# Altium schematic sheet 03 - Controller.SchDoc: Controller - 25kW WolfPACK FM3 Six-Pack Inverter
size 431 x 279 mm; Date: 01/2024; DocumentNumber: CRD25DA12N-FMC; Revision: 1.2; SheetNumber: 3; SheetTotal: 8; SheetSize: B
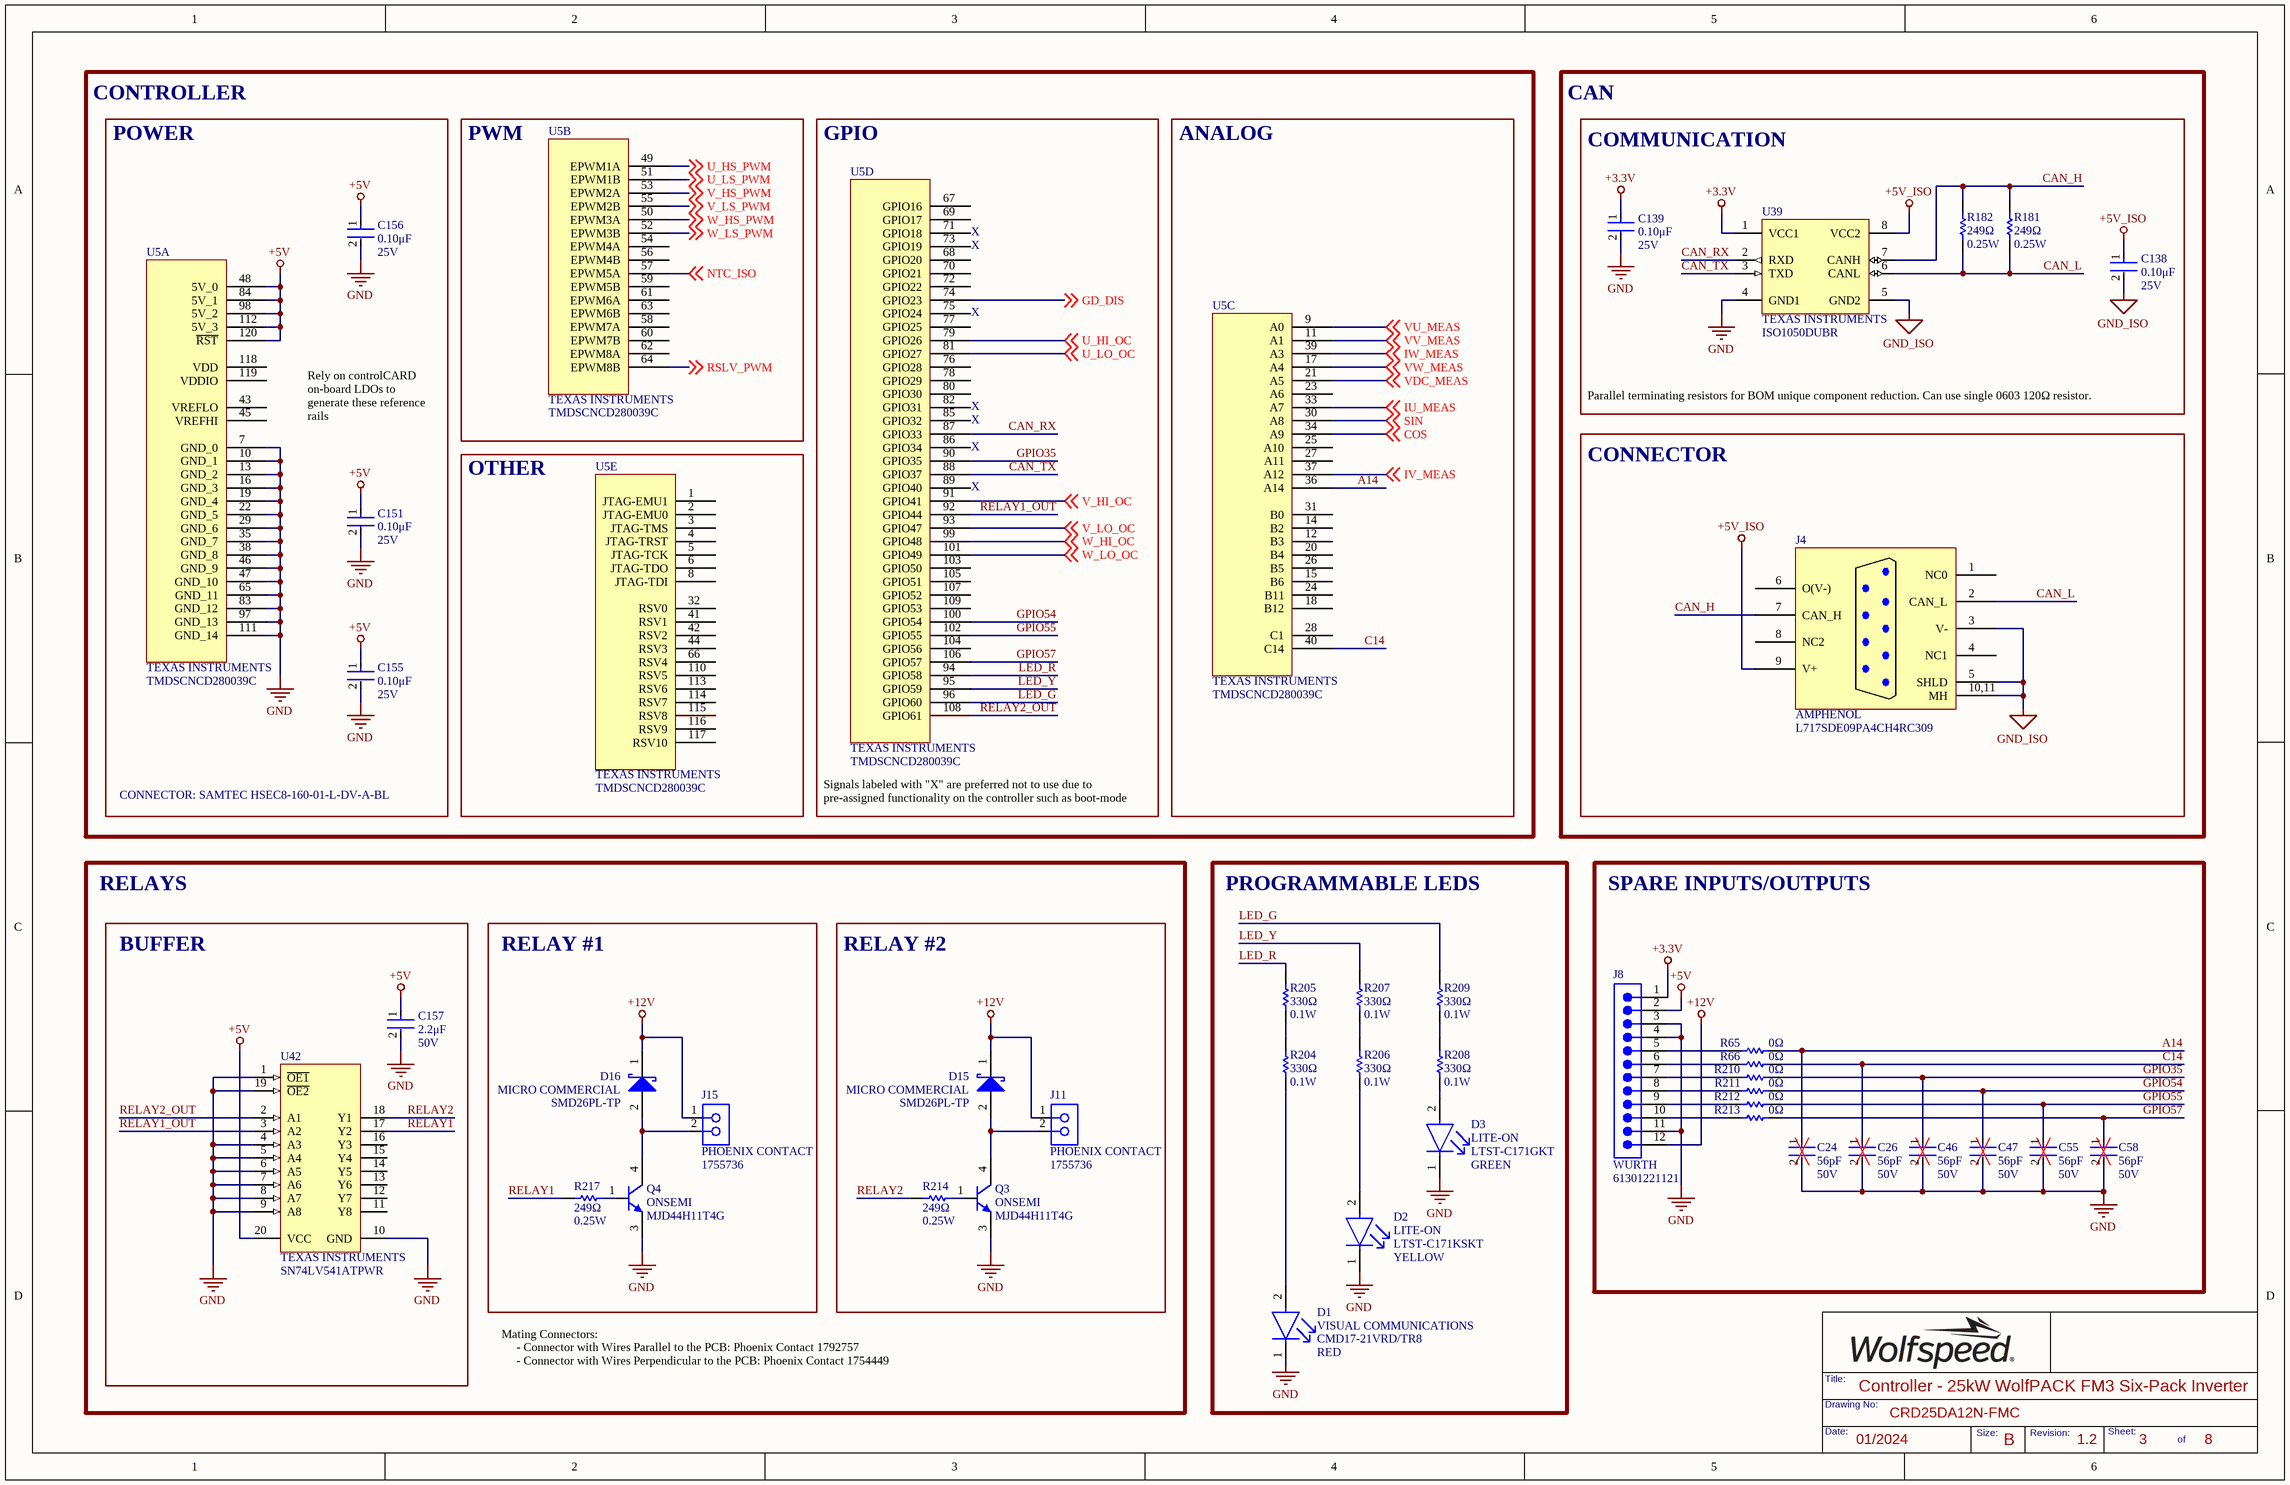
[diagram p0: 03 - Controller.SchDoc]

## Parts
C24  Capacitance: 56pF  Voltage Rating: 50V  [FP-C0603C-CF-IPC_B]  (hidden comment: CL10C560JB8NNNC)
C26  Capacitance: 56pF  Voltage Rating: 50V  [FP-C0603C-CF-IPC_B]  (hidden comment: CL10C560JB8NNNC)
C46  Capacitance: 56pF  Voltage Rating: 50V  [FP-C0603C-CF-IPC_B]  (hidden comment: CL10C560JB8NNNC)
C47  Capacitance: 56pF  Voltage Rating: 50V  [FP-C0603C-CF-IPC_B]  (hidden comment: CL10C560JB8NNNC)
C55  Capacitance: 56pF  Voltage Rating: 50V  [FP-C0603C-CF-IPC_B]  (hidden comment: CL10C560JB8NNNC)
C58  Capacitance: 56pF  Voltage Rating: 50V  [FP-C0603C-CF-IPC_B]  (hidden comment: CL10C560JB8NNNC)
C138  Voltage Rating: 25V  Capacitance: 0.10μF  [FP-C0603C-CF-IPC_B]  (hidden comment: C0603C104K3RACTU)
C139  Voltage Rating: 25V  Capacitance: 0.10μF  [FP-C0603C-CF-IPC_B]  (hidden comment: C0603C104K3RACTU)
C151  Voltage Rating: 25V  Capacitance: 0.10μF  [FP-C0603C-CF-IPC_B]  (hidden comment: C0603C104K3RACTU)
C155  Voltage Rating: 25V  Capacitance: 0.10μF  [FP-C0603C-CF-IPC_B]  (hidden comment: C0603C104K3RACTU)
C156  Voltage Rating: 25V  Capacitance: 0.10μF  [FP-C0603C-CF-IPC_B]  (hidden comment: C0603C104K3RACTU)
C157  Voltage Rating: 50V  Capacitance: 2.2μF  [FP-C0603C-CF-IPC_B]  (hidden comment: GRT188R61H225ME13D)
D1  value RED  Manufacturer: VISUAL COMMUNICATIONS  [FP-LTST-C171GKT-MFG-RED]  (hidden comment: CMD17-21VRD/TR8)
D2  LTST-C171KSKT  value YELLOW  Manufacturer: LITE-ON  [FP-LTST-C171GKT-MFG-YELLOW]
D3  value GREEN  Manufacturer: LITE-ON  [FP-LTST-C171GKT-MFG]  (hidden comment: LTST-C171GKT)
D15  SMD26PL-TP  Manufacturer: MICRO COMMERCIAL  [ONSC-SOD-123FL-2-498-01_V]
D16  SMD26PL-TP  Manufacturer: MICRO COMMERCIAL  [ONSC-SOD-123FL-2-498-01_V]
J4  Manufacturer: AMPHENOL  [L717SDE09PA4CH4RC309]  (hidden comment: L717SDE09PA4CH4RC309)
J8  Manufacturer Print: WURTH  [FP-61301221121-MFG]  (hidden comment: 61301221121)
J11  Manufacturer: PHOENIX CONTACT  [1755736]  (hidden comment: 1755736)
J15  Manufacturer: PHOENIX CONTACT  [1755736]  (hidden comment: 1755736)
Q3  Manufacturer: ONSEMI  [ONSC-DPAK-3-369C-01_V]  (hidden comment: MJD44H11T4G)
Q4  Manufacturer: ONSEMI  [ONSC-DPAK-3-369C-01_V]  (hidden comment: MJD44H11T4G)
R65  Resistance: 0Ω  [FP-MCR03-IPC_B]  (hidden comment: CRCW06030000Z0EB)
R66  Resistance: 0Ω  [FP-MCR03-IPC_B]  (hidden comment: CRCW06030000Z0EB)
R181  Resistance: 249Ω  Power Rating: 0.25W  [FP-MCR18-IPC_A]  (hidden comment: RC1206FR-07249RL)
R182  Resistance: 249Ω  Power Rating: 0.25W  [FP-MCR18-IPC_A]  (hidden comment: RC1206FR-07249RL)
R204  Resistance: 330Ω  Power Rating: 0.1W  [FP-MCR03-IPC_B]  (hidden comment: RC0603FR-13330RL)
R205  Resistance: 330Ω  Power Rating: 0.1W  [FP-MCR03-IPC_B]  (hidden comment: RC0603FR-13330RL)
R206  Resistance: 330Ω  Power Rating: 0.1W  [FP-MCR03-IPC_B]  (hidden comment: RC0603FR-13330RL)
R207  Resistance: 330Ω  Power Rating: 0.1W  [FP-MCR03-IPC_B]  (hidden comment: RC0603FR-13330RL)
R208  Resistance: 330Ω  Power Rating: 0.1W  [FP-MCR03-IPC_B]  (hidden comment: RC0603FR-13330RL)
R209  Resistance: 330Ω  Power Rating: 0.1W  [FP-MCR03-IPC_B]  (hidden comment: RC0603FR-13330RL)
R210  Resistance: 0Ω  [FP-MCR03-IPC_B]  (hidden comment: CRCW06030000Z0EB)
R211  Resistance: 0Ω  [FP-MCR03-IPC_B]  (hidden comment: CRCW06030000Z0EB)
R212  Resistance: 0Ω  [FP-MCR03-IPC_B]  (hidden comment: CRCW06030000Z0EB)
R213  Resistance: 0Ω  [FP-MCR03-IPC_B]  (hidden comment: CRCW06030000Z0EB)
R214  Resistance: 249Ω  Power Rating: 0.25W  [FP-MCR18-IPC_A]  (hidden comment: RC1206FR-07249RL)
R217  Resistance: 249Ω  Power Rating: 0.25W  [FP-MCR18-IPC_A]  (hidden comment: RC1206FR-07249RL)
U5  TMDSCNCD280039C  Manufacturer: TEXAS INSTRUMENTS  [TMDSCNCD280039C]  (parts A,B,C,D,E of 5)
U39  ISO1050DUBR  Manufacturer Print: TEXAS INSTRUMENTS  [DUB0008A_M]
U42  Manufacturer: TEXAS INSTRUMENTS  [PW0020A_L]  (hidden comment: SN74LV541ATPWR)

## Blocks framed on the sheet
POWER: C151 C155 C156 U5
PWM: U5
GPIO: U5
ANALOG: U5
COMMUNICATION: C138 C139 R181 R182 U39
CONNECTOR: J4
OTHER: U5
PROGRAMMABLE LEDS: D1-D3 R204-R209
SPARE INPUTS/OUTPUTS: C24 C26 C46 C47 C55 C58 J8 R65 R66 R210-R213
BUFFER: C157 U42
RELAY #1: D16 J15 Q4 R217
RELAY #2: D15 J11 Q3 R214

## Nets
+3.3V: C139.1 J8.1 U39.1(VCC1)
+5V: C151.1 C155.1 C156.1 C157.1 J8.2 U5.48(5V_0) U5.84(5V_1) U5.98(5V_2) U5.112(5V_3) U5.120(~{RST}) U42.20(VCC)
+5V_ISO: C138.1 J4.9(V+) U39.8(VCC2)
+12V: D15.1(K) D16.1(K) J8.12 J11.1 J15.1
GND: C24.2 C26.2 C46.2 C47.2 C55.2 C58.2 C139.2 C151.2 C155.2 C156.2 C157.2 D1.1(C) D2.1(C) D3.1(C) J8.3 J8.4 J8.11 Q3.3(E) Q4.3(E) U5.7(GND_0) U5.10(GND_1) U5.13(GND_2) U5.16(GND_3) U5.19(GND_4) U5.22(GND_5) U5.29(GND_6) U5.35(GND_7) U5.38(GND_8) U5.46(GND_9) U5.47(GND_10) U5.65(GND_11) U5.83(GND_12) U5.97(GND_13) U5.111(GND_14) U39.4(GND1) U42.1(~{OE1}) U42.4(A3) U42.5(A4) U42.6(A5) U42.7(A6) U42.8(A7) U42.9(A8) U42.10(GND) U42.19(~{OE2})
GND_ISO: C138.2 J4.3(V-) J4.5(SHLD) J4.10,11(MH) U39.5(GND2)
A14: C24.1 R65.2 U5.36(A14)
C14: C26.1 R66.2 U5.40(C14)
CAN_H: J4.7(CAN_H) R181.2 R182.2 U39.7(CANH)
CAN_L: J4.2(CAN_L) R181.1 R182.1 U39.6(CANL)
CAN_RX: U5.87(GPIO33) U39.2(RXD)
CAN_TX: U5.88(GPIO37) U39.3(TXD)
COS: U5.34(A9) ; off-sheet COS
GD_DIS: U5.74(GPIO23) ; off-sheet GD_DIS
GPIO35: C46.1 R210.2 U5.90(GPIO35)
GPIO54: C47.1 R211.2 U5.100(GPIO54)
GPIO55: C55.1 R212.2 U5.102(GPIO55)
GPIO57: C58.1 R213.2 U5.106(GPIO57)
IU_MEAS: U5.33(A7) ; off-sheet IU_MEAS
IV_MEAS: U5.37(A12) ; off-sheet IV_MEAS
IW_MEAS: U5.39(A3) ; off-sheet IW_MEAS
LED_G: R209.2 U5.96(GPIO60)
LED_R: R205.2 U5.94(GPIO58)
LED_Y: R207.2 U5.95(GPIO59)
NTC_ISO: U5.57(EPWM5A) ; off-sheet NTC_ISO
RELAY1: R217.1 U42.17(Y2)
RELAY1_OUT: U5.92(GPIO44) U42.3(A2)
RELAY2: R214.1 U42.18(Y1)
RELAY2_OUT: U5.108(GPIO61) U42.2(A1)
RSLV_PWM: U5.64(EPWM8B) ; off-sheet RSLV_PWM
SIN: U5.30(A8) ; off-sheet SIN
U_HI_OC: U5.79(GPIO26) ; off-sheet U_HI_OC
U_HS_PWM: U5.49(EPWM1A) ; off-sheet U_HS_PWM
U_LO_OC: U5.81(GPIO27) ; off-sheet U_LO_OC
U_LS_PWM: U5.51(EPWM1B) ; off-sheet U_LS_PWM
V_HI_OC: U5.91(GPIO41) ; off-sheet V_HI_OC
V_HS_PWM: U5.53(EPWM2A) ; off-sheet V_HS_PWM
V_LO_OC: U5.93(GPIO47) ; off-sheet V_LO_OC
V_LS_PWM: U5.55(EPWM2B) ; off-sheet V_LS_PWM
VDC_MEAS: U5.21(A5) ; off-sheet VDC_MEAS
VU_MEAS: U5.9(A0) ; off-sheet VU_MEAS
VV_MEAS: U5.11(A1) ; off-sheet VV_MEAS
VW_MEAS: U5.17(A4) ; off-sheet VW_MEAS
W_HI_OC: U5.99(GPIO48) ; off-sheet W_HI_OC
W_HS_PWM: U5.50(EPWM3A) ; off-sheet W_HS_PWM
W_LO_OC: U5.101(GPIO49) ; off-sheet W_LO_OC
W_LS_PWM: U5.52(EPWM3B) ; off-sheet W_LS_PWM
NetD1_2: D1.2(A) R204.1
NetD2_2: D2.2(A) R206.1
NetD3_2: D3.2(A) R208.1
NetD15_2: D15.2(A) J11.2 Q3.4(C)
NetD16_2: D16.2(A) J15.2 Q4.4(C)
NetJ8_5: J8.5 R65.1
NetJ8_6: J8.6 R66.1
NetJ8_7: J8.7 R210.1
NetJ8_8: J8.8 R211.1
NetJ8_9: J8.9 R212.1
NetJ8_10: J8.10 R213.1
NetQ3_1: Q3.1(B) R214.2
NetQ4_1: Q4.1(B) R217.2
NetR204_2: R204.2 R205.1
NetR206_2: R206.2 R207.1
NetR208_2: R208.2 R209.1

Not connected (* = marked no-connect by the designer): J4 1(NC0) 4(NC1) 6(O(V-)) 8(NC2); U5 1(JTAG-EMU1) 2(JTAG-EMU0) 3(JTAG-TMS) 4(JTAG-TRST) 5(JTAG-TCK) 6(JTAG-TDO) 8(JTAG-TDI) 12(B3) 14(B2) 15(B6) 18(B12) 20(B4) 23(A6) 24(B11) 25(A10) 26(B5) 27(A11) 28(C1) 31(B0) 32(RSV0) 41(RSV1) 42(RSV2) 43(VREFLO) 44(RSV3) 45(VREFHI) 54(EPWM4A) 56(EPWM4B) 58(EPWM7A) 59(EPWM5B) 60(EPWM7B) 61(EPWM6A) 62(EPWM8A) 63(EPWM6B) 66(RSV4) 67(GPIO16) 68(GPIO20) 69(GPIO17) 70(GPIO21) 71(GPIO18) 72(GPIO22) 73(GPIO19) 75(GPIO24) 76(GPIO28) 77(GPIO25) 78(GPIO29) 80(GPIO30) 82(GPIO31) 85(GPIO32) 86(GPIO34) 89(GPIO40) 103(GPIO50) 104(GPIO56) 105(GPIO51) 107(GPIO52) 109(GPIO53) 110(RSV5) 113(RSV6) 114(RSV7) 115(RSV8) 116(RSV9) 117(RSV10) 118(VDD) 119(VDDIO); U42 11(Y8) 12(Y7) 13(Y6) 14(Y5) 15(Y4) 16(Y3)

## Notes on the sheet
- CONTROLLER
- CAN
- (near U5) X
- Rely on controlCARD on-board LDOs to generate these reference rails
- Parallel terminating resistors for BOM unique component reduction. Can use single 0603 120Ω resistor.
- CONNECTOR: SAMTEC HSEC8-160-01-L-DV-A-BL
- Signals labeled with "X" are preferred not to use due to pre-assigned functionality on the controller such as boot-mode selection or on-board LEDs
- RELAYS
- Mating Connectors:
  - Connector with Wires Parallel to the PCB: Phoenix Contact 1792757
  - Connector with Wires Perpendicular to the PCB: Phoenix Contact 1754449
- Title:
- Date:
- Drawing No:
- Size:
- Revision:
- Sheet:
- of

## Library data of the parts
C24 C26 C46 C47 C55 C58 = CL10C560JB8NNNC: CAP CER 56PF 50V C0G/NP0 0603; Manufacturer: SAMSUNG; Material: Ceramic; Tolerance: 5%; Dielectric: C0G; Temperature Coefficient: 30ppm/°C; Supplier 1: Arrow Electronics; Manufacturer Part Number: CL10C560JB8NNNC; RoHS: Yes; Category: Ceramic Capacitors; Stock 1: 60182; Pricing 1: 1=0.05960, 10=0.01370, 25=0.01360, 100=0.01080, 250=0.01070, 500=0.00740, 1000=0.00590, 3000=0.00560, 6000=0.00530, 15000=0.00500, 30000=0.00470 (USD); Mount: Surface Mount; Case Code (Metric): 1608; Case Code (Imperial): 0603; Min Operating Temperature: -55°C; Max Operating Temperature: 125°C; Packaging: Tape and Reel; Package Quantity: 1; Voltage: 50V; Voltage Rating (DC): 50V; Series: CL; Construction: Flat; Termination: SMD/SMT; Length: 1.6mm; Width: 0.031inch; Height: 0.8mm; Thickness: 0.035inch; Depth: 0.8mm; Radiation Hardening: No; Lead Free: Lead Free; RoHS Compliant: Yes; ComponentLink1URL: https://datasheet.ciiva.com/25803/cl10c560jb8nnnc-25803592.pdf?src-supplier=Digi-Key; ComponentLink1Description: https://datasheet.ciiva.com/25803/cl10c560jb8nnnc-25803592.pdf?src-supplier=Digi-Key; ComponentLink2URL: https://datasheet.ciiva.com/26838/getdatasheetpartid-640760-26838546.pdf?src-supplier=Verical; ComponentLink2Description: https://datasheet.ciiva.com/26838/getdatasheetpartid-640760-26838546.pdf?src-supplier=Verical; ComponentLink3URL: https://datasheet.ciiva.com/29198/456837-da-01-en-vs-kondensator-0603-29198873.pdf?src-supplier=Conrad; ComponentLink3Description: https://datasheet.ciiva.com/29198/456837-da-01-en-vs-kondensator-0603-29198873.pdf?src-supplier=Conrad; ComponentLink4URL: https://datasheet.ciiva.com/48428/mlcc-catalogdownload2013-eng-48428598.pdf?src-supplier=Distrelec; ComponentLink4Description: https://datasheet.ciiva.com/48428/mlcc-catalogdownload2013-eng-48428598.pdf?src-supplier=Distrelec; ComponentLink5URL: https://datasheet.ciiva.com/16449/cl05b104kq5nnnc-16449527.pdf?src-supplier=Future+Electronics; ComponentLink5Description: https://datasheet.ciiva.com/16449/cl05b104kq5nnnc-16449527.pdf?src-supplier=Future+Electronics; Supplier Part Number 1: CL10C560JB8NNNC; Package: 0603; Value: 56pF
C138 C139 C151 C155 C156 = CMP-2006-03057-2: CAP CER 0.1UF 25V X7R 0603; Manufacturer: KEMET; Value: 0.10μF; Material: Ceramic; Tolerance: 0.1; Temperature Coefficient: 30ppm/°C; Automotive Grade: Grade 1; Lead Free: Yes; Device Class L3: Ceramic Capacitors; Manufacturer Part Number: C0603C104K3RACTU; Digikey Description: CAP CER 0.1UF 25V X7R 0603; Mouser Description: Multilayer Ceramic Capacitors MLCC - SMD/SMT 25volts 0.1uF X7R 10%; Package: 0603; Temperature Range Low: -55°C; Automotive: Yes; Device Class L2: Capacitors; Octopart: https://octopart.com/c0603c104k3ractu-kemet-127541; ComponentLink2Description: Datasheet; ComponentLink2URL: https://api.kemet.com/component-edge/download/datasheet/C0603C100J5GACAUTO.pdf; Temperature Range High: +125°C; RoHS: TRUE; Device Class L1: Passive Components; Category: Cap; Temperature: -55°C to +125°C; Height: 0.87mm; Temperature Characteristic: X7R
C157 = GRT188R61H225ME13D: CAP CER 2.2UF 50V X5R 0603; Manufacturer: MURATA; Tolerance: 20%; Value: 2.2μF; Supplier 1: Arrow Electronics; Manufacturer Part Number: GRT188R61H225ME13D; RoHS: Yes; Category: Ceramic Capacitors; Stock 1: 3937; Pricing 1: 1=0.29580, 10=0.20370, 25=0.18090, 100=0.12380, 250=0.12190, 500=0.10920, 1000=0.07700, 3000=0.07630 (USD); Mount: Surface Mount; Case Code (Metric): 1608; Case Code (Imperial): 0603; Min Operating Temperature: -55°C; Max Operating Temperature: 85°C; Packaging: Tape and Reel; Length: 0.063inch; Width: 0.031inch; Thickness: 0.035inch; Ratings: AEC-Q200; RoHS Compliant: Yes; ComponentLink1URL: http://search.murata.co.jp/Ceramy/image/img/A01X/G101/ENG/GRT188R61H225ME13-01.pdf?src-supplier=Digi-Key; ComponentLink1Description: http://search.murata.co.jp/Ceramy/image/img/A01X/G101/ENG/GRT188R61H225ME13-01.pdf?src-supplier=Digi-Key; ComponentLink2URL: https://search.murata.co.jp/Ceramy/image/img/A01X/G101/ENG/GRT188R61H225ME13-01.pdf?src-supplier=Digi-Key; ComponentLink2Description: https://search.murata.co.jp/Ceramy/image/img/A01X/G101/ENG/GRT188R61H225ME13-01.pdf?src-supplier=Digi-Key; Supplier Part Number 1: GRT188R61H225ME13D; Package: 0603
D1 = CMD17-21VRD/TR8: LED RED DIFFUSED 0805 SMD; Power Rating: 100mW; Luminous Intensity: 6mcd; Viewing Angle: 140°; Lens Style: Diffused,Tinted,Rectangular,Colored; Forward Current: 20mA; Forward Voltage: 2V; Wavelength: 640nm; Reverse Voltage (DC): 5V; Number of LEDs: 1; Supplier 1: Newark; RoHS: Yes; Category: LEDs; Stock 1: 1791; Pricing 1: 1=0.55000, 25=0.37500, 50=0.31600, 100=0.25700, 250=0.25600, 500=0.25400, 1000=0.21500 (USD); Mount: Surface Mount; Package: 0805; Number of Pins: 2; Color: RED; Case Code (Metric): 2012; Case Code (Imperial): 0805; Lens Color: Red; Min Operating Temperature: -40°C; Max Operating Temperature: 85°C; Packaging: Tape and Reel; Package Quantity: 1; Illumination Color: Red; Test Current: 20mA; Reverse Voltage: 5V; Length: 2mm; Width: 1.25mm; Height: 1.1mm; RoHS Compliant: Yes; Lead Free: Lead Free; ComponentLink1URL: http://www.mouser.com/ds/2/423/CMD1721ver1-1064576.pdf?src-supplier=Mouser; ComponentLink1Description: http://www.mouser.com/ds/2/423/CMD1721ver1-1064576.pdf?src-supplier=Mouser; ComponentLink2URL: https://www.alliedelec.com/m/d/ea8f758becbd32522d2612194452bcae.pdf?src-supplier=Allied+Electronics; ComponentLink2Description: https://www.alliedelec.com/m/d/ea8f758becbd32522d2612194452bcae.pdf?src-supplier=Allied+Electronics; ComponentLink3URL: http://www.onlinecomponents.com/productFiles/mf-CM/2cmd17-21seriessmtleds0805packagesize.pdf?src-supplier=Onlinecomponents.com; ComponentLink3Description: http://www.onlinecomponents.com/productFiles/mf-CM/2cmd17-21seriessmtleds0805packagesize.pdf?src-supplier=Onlinecomponents.com; ComponentLink4URL: https://vcclite.com/wp-content/uploads/wpallimport/files/files/CMD1721Seriesver3.pdf?src-supplier=Digi-Key; ComponentLink4Description: https://vcclite.com/wp-content/uploads/wpallimport/files/files/CMD1721Seriesver3.pdf?src-supplier=Digi-Key; Supplier Part Number 1: 45X6246; Manufacturer Part Number: CMD17-21VRD/TR8
D2 = LTST-C171KSKT: LED YELLOW CLEAR 0805 SMD; Lens Color: Colorless; Number of LEDs: 1; Reverse Voltage: 5V; Viewing Angle: 130°; Lens Style: Diffused,Colorless,Rectangular,Clear; Luminous Intensity: 50mcd; Forward Voltage: 2V; Dominant Wavelength: 587nm; Test Current: 20mA; Wavelength: 588nm; Forward Current: 30mA; Max Power Dissipation: 75mW; Supplier 1: Rs; Manufacturer Part Number: LTST-C171KSKT; RoHS: Yes; Category: LEDs; Stock 1: 850; Mount: Surface Mount; Package: 0805; Number of Pins: 2; Color: Yellow; Case Code (Metric): 2012; Case Code (Imperial): 0805; Min Operating Temperature: -55°C; Max Operating Temperature: 85°C; Package Quantity: 1; Packaging: Tape and Reel; Lens Transparency: Clear; Series: CHIPLED 0805; Illumination Color: Yellow; Power Rating: 75mW; Number of Elements: 1; Power Dissipation: 75mW; Length: 2mm; Width: 1.25mm; Height: 0.8mm; Depth: 1.25mm; Radiation Hardening: No; Lead Free: Lead Free; RoHS Compliant: Yes; ComponentLink1URL: https://datasheet.ciiva.com/19466/2075639-19466196.pdf?src-supplier=Jameco; ComponentLink1Description: https://datasheet.ciiva.com/19466/2075639-19466196.pdf?src-supplier=Jameco; ComponentLink2URL: https://datasheet.ciiva.com/12403/lite-on-ltst-c171kskt-190118-12403721.pdf?src-supplier=Mouser; ComponentLink2Description: https://datasheet.ciiva.com/12403/lite-on-ltst-c171kskt-190118-12403721.pdf?src-supplier=Mouser; ComponentLink3URL: https://datasheet.ciiva.com/16200/lite-on20ltst-c171kskt-16200102.pdf?src-supplier=Future+Electronics; ComponentLink3Description: https://datasheet.ciiva.com/16200/lite-on20ltst-c171kskt-16200102.pdf?src-supplier=Future+Electronics; ComponentLink4URL: https://datasheet.ciiva.com/15118/getdatasheetpartid-233685-15118145.pdf?src-supplier=Verical; ComponentLink4Description: https://datasheet.ciiva.com/15118/getdatasheetpartid-233685-15118145.pdf?src-supplier=Verical; ComponentLink5URL: https://datasheet.ciiva.com/11774/0900766b80dc029a-11774587.pdf?src-supplier=Rs; ComponentLink5Description: https://datasheet.ciiva.com/11774/0900766b80dc029a-11774587.pdf?src-supplier=Rs; ComponentLink6URL: https://datasheet.ciiva.com/2110/s-110-ltst-c171kskt-2110148.pdf?src-supplier=Digi-Key; ComponentLink6Description: https://datasheet.ciiva.com/2110/s-110-ltst-c171kskt-2110148.pdf?src-supplier=Digi-Key; ComponentLink7URL: https://datasheet.ciiva.com/2110/s-110-ltst-c171kskt-2110147.pdf?src-supplier=Digi-Key; ComponentLink7Description: https://datasheet.ciiva.com/2110/s-110-ltst-c171kskt-2110147.pdf?src-supplier=Digi-Key; ComponentLink8URL: https://datasheet.ciiva.com/2110/s-110-ltst-c171kskt-2110149.pdf?src-supplier=Digi-Key; ComponentLink8Description: https://datasheet.ciiva.com/2110/s-110-ltst-c171kskt-2110149.pdf?src-supplier=Digi-Key; Supplier Part Number 1: 6920950
D3 = CMP-22017-000007-1: LED GREEN CLEAR CHIP SMD; Luminous Intensity: 12mcd; Lens Color: Colorless; Dominant Wavelength: 569nm; Number of LEDs: 1; Power Dissipation: 100mW; Viewing Angle: 130°; Reverse Voltage: 5V; Test Current: 10mA; Forward Voltage: 2.1V; Wavelength: 585nm; Lens Style: Diffused; Forward Current: 30mA; Height: 0.8mm; Mount: Surface Mount; Package Quantity: 1; Length: 2mm; Case Code (Metric): 2012; Number of Pins: 2; Number of Elements: 1; Packaging: Tape and Reel; Color: GREEN; Min Operating Temperature: -55°C; Case/Package: 0805; Power Rating: 100mW; Max Operating Temperature: 85°C; Radiation Hardening: No; Depth: 1.25mm; Lens Transparency: Clear; Width: 1.25mm; Lead Free: Lead Free; Case Code (Imperial): 0805; Illumination Color: Green; Manufacturer Part Number: LTST-C171GKT; Package: 0805
D15 D16 = SMD26PL-TP: DIODE SCHOTTKY 60V 2A SOD123FL; Forward Voltage: 700mV; Max Reverse Current: 500uA; Max Surge Current: 50A; Max Power Dissipation: 1.68W; Supplier 1: Digi-Key; Manufacturer Part Number: SMD26PL-TP; RoHS: Yes; Category: Rectifier Diodes; Stock 1: 317348; Pricing 1: 1=0.40000, 10=0.30200, 100=0.18790, 500=0.12854, 1000=0.09888 (USD); Mount: Surface Mount; Number of Pins: 2; Min Operating Temperature: -65°C; Max Operating Temperature: 125°C; Packaging: Tape and Reel; Package Quantity: 1; Average Rectified Current: 2A; Max Repetitive Reverse Voltage (Vrrm): 60V; Max Reverse Voltage (DC): 60V; Lead Free: Lead Free; RoHS Compliant: Yes; ComponentLink1URL: https://datasheet.ciiva.com/4717/smd22pl-smd210plsod-123fl-27814-4717414.pdf?src-supplier=Mouser; ComponentLink1Description: https://datasheet.ciiva.com/4717/smd22pl-smd210plsod-123fl-27814-4717414.pdf?src-supplier=Mouser; ComponentLink2URL: https://datasheet.ciiva.com/17444/smd22pl-smd210plsod-123fl-17444944.pdf?src-supplier=Future+Electronics; ComponentLink2Description: https://datasheet.ciiva.com/17444/smd22pl-smd210plsod-123fl-17444944.pdf?src-supplier=Future+Electronics; ComponentLink3URL: https://datasheet.ciiva.com/917/smd22pl-smd210plsod-123fl-917242.pdf?src-supplier=Digi-Key; ComponentLink3Description: https://datasheet.ciiva.com/917/smd22pl-smd210plsod-123fl-917242.pdf?src-supplier=Digi-Key; ComponentLink4URL: https://datasheet.ciiva.com/917/smd22pl-smd210plsod-123fl-917243.pdf?src-supplier=Digi-Key; ComponentLink4Description: https://datasheet.ciiva.com/917/smd22pl-smd210plsod-123fl-917243.pdf?src-supplier=Digi-Key; ComponentLink5URL: https://datasheet.ciiva.com/917/smd22pl-smd210plsod-123fl-917244.pdf?src-supplier=Digi-Key; ComponentLink5Description: https://datasheet.ciiva.com/917/smd22pl-smd210plsod-123fl-917244.pdf?src-supplier=Digi-Key; Supplier Part Number 1: SMD26PL-TPMSCT-ND; Package: SOD-123F; Value: N/A
J4 = L717SDE09PA4CH4RC309: CONN D-SUB PLUG 9POS R/A SLDR; Number of Terminals/Pins: 9; Connector Type: D-Sub,Plug; Voltage Rating: 250V; Current Rating: 5A; Number of Ports: 1; Pitch: 2.74mm; Value: N/A; Package: N/A; Supplier 1: Allied Electronics; RoHS: Yes; Category: Uncategorized; Mount: Through Hole; Contact Plating: Gold; Contact Material: Brass; Color: Black; Housing Material: Thermoplastic; Min Operating Temperature: -55°C; Max Operating Temperature: 155°C; Number of Rows: 2; Packaging: Tray; Number of Positions: 9; Termination: Solder; Max Supply Voltage (AC): 250V; Number of Contacts: 9; Orientation: Right Angle; Series: SD; Contact Type: Signal; Length: 30.81mm; Depth: 20.3mm; Lead Free: Lead Free; RoHS Compliant: Yes; ComponentLink1URL: https://datasheet.ciiva.com/16443/l717sde09pa4ch4rc309-16443356.pdf?src-supplier=Future+Electronics; ComponentLink1Description: https://datasheet.ciiva.com/16443/l717sde09pa4ch4rc309-16443356.pdf?src-supplier=Future+Electronics; ComponentLink2URL: https://datasheet.ciiva.com/12662/l717sde09pa4ch4rc309-12662371.pdf?src-supplier=Mouser; ComponentLink2Description: https://datasheet.ciiva.com/12662/l717sde09pa4ch4rc309-12662371.pdf?src-supplier=Mouser; ComponentLink3URL: https://datasheet.ciiva.com/16914/70145027-16914009.pdf?src-supplier=Allied+Electronics; ComponentLink3Description: https://datasheet.ciiva.com/16914/70145027-16914009.pdf?src-supplier=Allied+Electronics; ComponentLink4URL: https://datasheet.ciiva.com/16748/sd-hdh808-16748518.pdf?; ComponentLink4Description: https://datasheet.ciiva.com/16748/sd-hdh808-16748518.pdf?; Supplier Part Number 1: 70145033; Manufacturer Part Number: L717SDE09PA4CH4RC309
J8 = 61301221121: CONN HEADER VERT 12POS 2.54MM; Manufacturer: WURTH ELEKTRONIK; Number of Positions: 12; Gender: Male; Voltage Rating: 250V; Pitch: 0.1inch; Supplier 1: Digi-Key; RoHS: Yes; Category: Headers and Wire Housings; Stock 1: 5429; Pricing 1: 1=0.83000, 10=0.70700, 25=0.58920, 50=0.49100, 100=0.44700, 1000=0.40600 (USD); Mount: Through Hole; Contact Plating: Gold; Contact Material: Copper Alloy,Copper; Color: Black; Contact Shape: Square; Contact Finish - Mating: GOLD; Insulation Material: Nylon; Insulation Color: Black; Min Operating Temperature: -40°C; Max Operating Temperature: 105°C; Number of Rows: 2; Packaging: Bulk; Termination: Solder; Number of Contacts: 12; Connector Type: Header; Fastening Type: Pull; Series: WR-PHD; Contact Type: Male Pin; Row Spacing: 0.1inch; Contact Mating Length: 0.236inch; RoHS Compliant: Yes; Flammability Rating: UL94 V-0; ComponentLink1URL: http://www.farnell.com/datasheets/1442180.pdf?src-supplier=Farnell; ComponentLink1Description: http://www.farnell.com/datasheets/1442180.pdf?src-supplier=Farnell; ComponentLink2URL: http://www.farnell.com/datasheets/1442180.pdf?src-supplier=Newark; ComponentLink2Description: http://www.farnell.com/datasheets/1442180.pdf?src-supplier=Newark; ComponentLink3URL: http://www.farnell.com/datasheets/1442180.pdf?src-supplier=Element14; ComponentLink3Description: http://www.farnell.com/datasheets/1442180.pdf?src-supplier=Element14; ComponentLink4URL: https://katalog.we-online.de/em/datasheet/6130xx21121.pdf?src-supplier=Digi-Key; ComponentLink4Description: https://katalog.we-online.de/em/datasheet/6130xx21121.pdf?src-supplier=Digi-Key; Supplier Part Number 1: 732-5297-ND; Package: N/A; Value: N/A; Manufacturer Part Number: 61301221121
J11 J15 = 1755736: TERM BLOCK HDR 2POS VERT 5.08MM; Content: 250pc(s); Industrial packaging: Yes; Number of contacts: 2; Manufacturer URL: http://www.phoenixcontact.com/; Datasheet Version: Apr-16; Pitch: 5.08mm; Datasheet URL: http://www.mouser.com/ds/2/324/ItemDetail_1755736-921028.pdf; Manufacturer Part Number: 1755736; Type: MSTBVA2,5/2-G-5,08; Colour: Green; Supplier 1: Rs; Supplier Part Number 1: 1896199; Value: N/A; Package: N/A
Q3 Q4 = CMP-1046-00010-1: TRANS NPN 80V 8A DPAK; IC Continuous (A): 8; Packing: Tape and Reel; PackageVersion: Rev. E, 02/2014; Polarity: NPN; ComponentLink2Description: Datasheet; ComponentLink2URL: http://www.onsemi.cn/pub_link/Collateral/MJD44H11-D.PDF; ComponentLink1URL: http://www.onsemi.com/; PackageReference: DPAK-3-369C-01; Mounting Technology: Surface Mount; ComponentLink1Description: Manufacturer URL; ComponentLink3URL: http://www.onsemi.cn/pub_link/Collateral/369C.PDF; ComponentLink3Description: Package Specification; PartNumber: MJD44H11T4G; PackageDescription: 3-Pin Flange Mount, Body 6.54 x 6.095 mm, Pitch 2.29 mm; DatasheetVersion: Rev. 16; RoHS: TRUE; Value: N/A; Manufacturer Part Number: MJD44H11T4G; Package: TO-252-3
R65 R66 R210-R213 = CRCW06030000Z0EB: RES SMD 0 OHM JUMPER 1/10W 0603; Manufacturer: VISHAY DALE; Manufacturer Part Number: CRCW06030000Z0EBC; Max Power Dissipation: 100mW; Voltage Rating: 75V; Tolerance: 1%; Temperature Coefficient: 100ppm/°C; Value: 0Ω; Supplier 1: Newark; RoHS: Yes; Category: Chip SMD Resistors; Stock 1: 110000; Pricing 1: 1=0.00300, 10000=0.00300 (USD); Package: 0603; Number of Pins: 2; Case Code (Imperial): 0603; Case Code (Metric): 1608; Weight: 7.1E-05oz; Contact Plating: Tin; Size Code: 0603; Min Operating Temperature: -55°C; Max Operating Temperature: 155°C; Packaging: Tape and Reel; Resistor Type: Thick Film; Number of Terminations: 2; Features: Automotive AEC-Q200; Package Quantity: 10000; Termination: SMD/SMT; Voltage Rating (DC): 75V; Series: CRCW; Construction: Rectangular; Technology: THICK FILM; Length: 1.55mm; Width: 0.033inch; Height: 0.45mm; Depth: 0.85mm; Ratings: AEC-Q200; Radiation Hardening: No; RoHS Compliant: Yes; Lead Free: Lead Free; Military Standard: Not; ComponentLink1URL: https://datasheet.ciiva.com/11808/0900766b80d98afc-11808678.pdf?src-supplier=Rs; ComponentLink1Description: https://datasheet.ciiva.com/11808/0900766b80d98afc-11808678.pdf?src-supplier=Rs; ComponentLink2URL: https://datasheet.ciiva.com/2563/dcrcwe3-2563949.pdf?src-supplier=Digi-Key; ComponentLink2Description: https://datasheet.ciiva.com/2563/dcrcwe3-2563949.pdf?src-supplier=Digi-Key; ComponentLink3URL: https://datasheet.ciiva.com/5550/dcrcwe3-109170-5550748.pdf?src-supplier=Mouser; ComponentLink3Description: https://datasheet.ciiva.com/5550/dcrcwe3-109170-5550748.pdf?src-supplier=Mouser; ComponentLink4URL: https://datasheet.ciiva.com/16430/dcrcwe3-16430060.pdf?src-supplier=Future+Electronics; ComponentLink4Description: https://datasheet.ciiva.com/16430/dcrcwe3-16430060.pdf?src-supplier=Future+Electronics; ComponentLink5URL: https://datasheet.ciiva.com/7791/dcrcwe3-7791992.pdf?src-supplier=Element14; ComponentLink5Description: https://datasheet.ciiva.com/7791/dcrcwe3-7791992.pdf?src-supplier=Element14; Supplier Part Number 1: 48P7902
R181 R182 R214 R217 = RC1206FR-07249RL: RES 249 OHM 1% 1/4W 1206; Manufacturer: YAGEO; Voltage Rating: 200V; Temperature Coefficient: 100ppm/°C; Max Power Dissipation: 250mW; Value: 249Ω; Supplier 1: Future Electronics; Manufacturer Part Number: RC1206FR-07249RL; RoHS: Yes; Category: Chip SMD Resistors; Stock 1: 560000; Pricing 1: 5000=0.00430, 25000=0.00410, 100000=0.00390, 250000=0.00370, 625000=0.00350 (USD); Package: 1206; Case Code (Imperial): 1206; Case Code (Metric): 3216; Size Code: 1206; Min Operating Temperature: -55°C; Max Operating Temperature: 155°C; Tolerance: 1%; Packaging: Tape and Reel; Termination: SMD/SMT; Resistor Type: Thick Film; Voltage Rating (DC): 200V; Features: Moisture Resistant; Series: RC; Number of Terminations: 2; Construction: Rectangular; Length: 3.1mm; Depth: 1.6mm; Military Standard: Not; Lead Free: Lead Free; RoHS Compliant: Yes; ComponentLink1URL: https://datasheet.ciiva.com/16747/pyu-rc1206-51-rohs-l-4-16747103.pdf?src-supplier=Future+Electronics; ComponentLink1Description: https://datasheet.ciiva.com/16747/pyu-rc1206-51-rohs-l-4-16747103.pdf?src-supplier=Future+Electronics; Supplier Part Number 1: 1142064
R204-R209 = RC0603FR-13330RL: RES 330 OHM 1% 1/10W 0603; Manufacturer: YAGEO; Voltage Rating: 50V; Temperature Coefficient: 100ppm/°C; Value: 330Ω; Supplier 1: Future Electronics; Manufacturer Part Number: RC0603FR-13330RL; RoHS: Yes; Category: Chip SMD Resistors; Stock 1: 560000; Pricing 1: 20000=0.00130, 80000=0.00120, 400000=0.00120, 800000=0.00110, 2500000=0.00110 (USD); Package: 0603; Case Code (Imperial): 0603; Case Code (Metric): 1608; Min Operating Temperature: -55°C; Max Operating Temperature: 155°C; Tolerance: 1%; Packaging: Tape and Reel; Resistor Type: Thick Film; Termination: SMD/SMT; Series: RC; Construction: Rectangular; Length: 1.6mm; Width: 0.8mm; Height: 0.45mm; Depth: 0.8mm; Military Standard: Not; RoHS Compliant: Yes; ComponentLink1URL: https://datasheet.ciiva.com/12561/rc0603-272842-12561430.pdf?src-supplier=Mouser; ComponentLink1Description: https://datasheet.ciiva.com/12561/rc0603-272842-12561430.pdf?src-supplier=Mouser; Supplier Part Number 1: 4067719
U5 = TMDSCNCD280039C: EVAL BOARD FOR TMS320F280039C; Supplier 1: Mouser; Manufacturer Part Number: TMDSCNCD280039C; RoHS: No; Category: Embedded Processors and Controllers; Stock 1: 11; Pricing 1: 1=99.75000, 10=99.75000, 50=99.75000, 100=99.75000, 1000=99.75000, 10000=99.75000 (USD); Supplier Part Number 1: 595-TMDSCNCD280039C; Value: N/A; Package: N/A
U39 = ISO1050DUBR: IC TXRX/ISO HALF 1/1 8SOP; Rating: Catalog; Eco-Plan: Green (RoHS & no Sb/Br); Isolated: Yes; Drivers Per Package: 1; SubFamily: CAN; Manufacturer: TEXAS INSTRUMENTS; PackageReference: DUB0008A; PartNumber: ISO1050DUBR; ComponentLink2Description: Package Specification; ComponentLink1Description: Datasheet; Mounting Technology: Surface Mount; ComponentLink1URL: http://www.ti.com/general/docs/lit/getliterature.tsp?genericPartNumber=ISO1050&fileType=pdf; ComponentLink2URL: http://www.ti.com/litv/pdf/mpds247b; PackageDescription: 8-Pin Small Outline Package 2.54 mm Pitch; PackageVersion: revC, May-2006; DatasheetVersion: SLLS983E; Supplier 1: Arrow Electronics; Supplier Part Number 1: ISO1050DUBR; Manufacturer Part Number: ISO1050DUBR; Value: N/A; Package: 8-SOP
U42 = CMP-0440-01163-3: IC BUF NON-INVERT 5.5V 20TSSOP; Bits(#): 8; Voltage(Nom)(V): 5; ICC @ Nom Voltage(Max)(mA): 0.02; VCC(Max)(V): 5.5; Output Type: CMOS; Rating: Catalog; Input Type: TTL; VCC(Min)(V): 4.5; F @ Nom Voltage(Max)(Mhz): 110; tpd @ Nom Voltage(Max)(ns): 7.9; Code_JEDEC: MO-153; PackageReference: PW0020A; DatasheetVersion: SCES573B; Generic Part Number: SN74LV541AT; Operating Temperature Range(C): -40 to 125; PackageVersion: http://www.ti.com/lit/ml/mpds362/mpds362.pdf; Package: 20-TSSOP; Value: N/A; Manufacturer Part Number: SN74LV541ATPWR